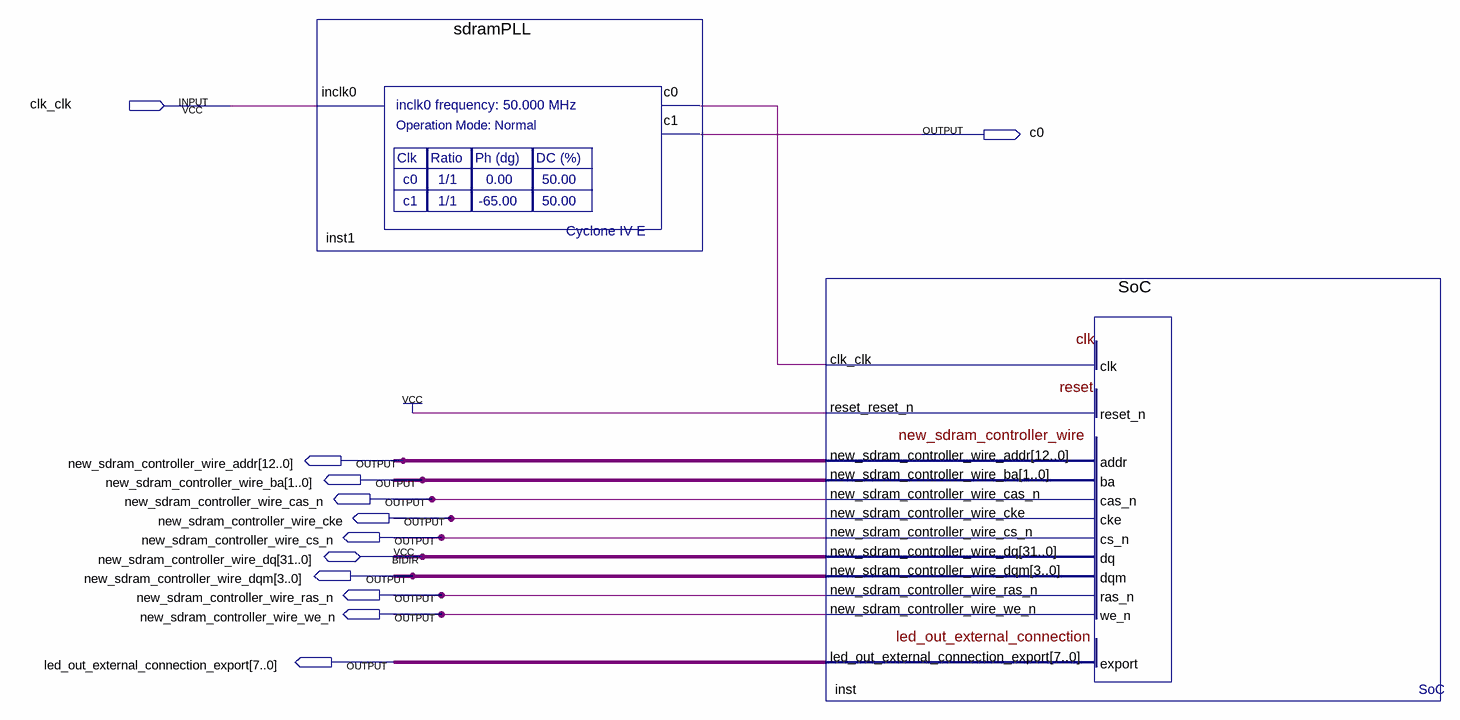
[diagram p0: schematic sheet]
// Quartus schematic TopModule.bdf as structural Verilog: 2 symbols, 12 pins
module TopModule (
  input  clk_clk,
  inout  [31:0] new_sdram_controller_wire_dq,
  output c0,
  output [12:0] new_sdram_controller_wire_addr,
  output [1:0] new_sdram_controller_wire_ba,
  output new_sdram_controller_wire_cas_n,
  output new_sdram_controller_wire_cke,
  output new_sdram_controller_wire_cs_n,
  output [3:0] new_sdram_controller_wire_dqm,
  output new_sdram_controller_wire_ras_n,
  output new_sdram_controller_wire_we_n,
  output [7:0] led_out_external_connection_export
);

  wire inst1_c0;

  sdramPLL inst1 (.inclk0(clk_clk), .c0(inst1_c0), .c1(c0));
  SoC inst (
    .clk_clk(inst1_c0), .reset_reset_n(1'b1),
    .new_sdram_controller_wire_addr(new_sdram_controller_wire_addr),
    .new_sdram_controller_wire_ba(new_sdram_controller_wire_ba),
    .new_sdram_controller_wire_cas_n(new_sdram_controller_wire_cas_n),
    .new_sdram_controller_wire_cke(new_sdram_controller_wire_cke),
    .new_sdram_controller_wire_cs_n(new_sdram_controller_wire_cs_n),
    .new_sdram_controller_wire_dqm(new_sdram_controller_wire_dqm),
    .new_sdram_controller_wire_ras_n(new_sdram_controller_wire_ras_n),
    .new_sdram_controller_wire_we_n(new_sdram_controller_wire_we_n),
    .led_out_external_connection_export(led_out_external_connection_export),
    .new_sdram_controller_wire_dq(new_sdram_controller_wire_dq));
endmodule
